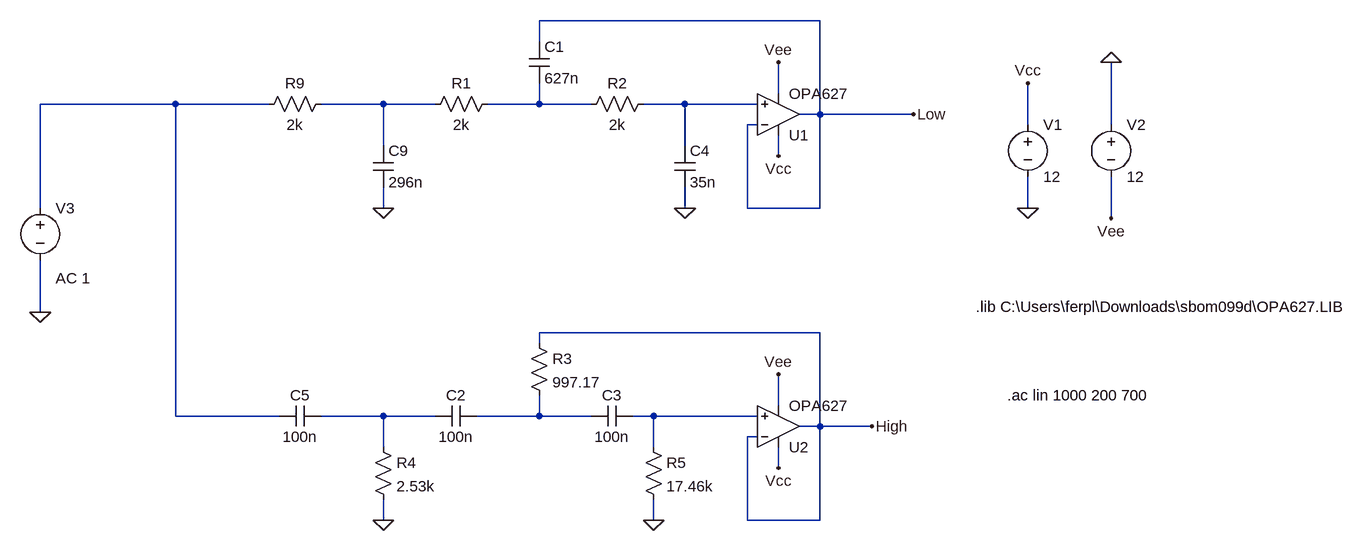
[diagram p0: schematic Butterworth3erOrden.asc]
Butterworth3erOrden.asc, the LTspice schematic file:
Version 4
SHEET 1 1732 884
WIRE 672 96 240 96
WIRE 240 128 240 96
WIRE 608 208 608 160
WIRE -320 224 -528 224
WIRE -176 224 -320 224
WIRE 0 224 -96 224
WIRE 80 224 0 224
WIRE 240 224 240 192
WIRE 240 224 160 224
WIRE 320 224 240 224
WIRE 464 224 400 224
WIRE 576 224 464 224
WIRE 672 240 672 96
WIRE 672 240 640 240
WIRE 816 240 672 240
WIRE 576 256 560 256
WIRE 992 256 992 192
WIRE 1120 256 1120 160
WIRE 0 288 0 224
WIRE 464 288 464 224
WIRE 608 304 608 272
WIRE -528 384 -528 224
WIRE 0 384 0 352
WIRE 464 384 464 352
WIRE 560 384 560 256
WIRE 672 384 672 240
WIRE 672 384 560 384
WIRE 992 384 992 336
WIRE 1120 400 1120 336
WIRE -528 544 -528 464
WIRE 672 576 240 576
WIRE 240 592 240 576
WIRE 608 688 608 640
WIRE -320 704 -320 224
WIRE -160 704 -320 704
WIRE 0 704 -96 704
WIRE 80 704 0 704
WIRE 240 704 240 672
WIRE 240 704 144 704
WIRE 320 704 240 704
WIRE 416 704 384 704
WIRE 576 704 416 704
WIRE 672 720 672 576
WIRE 672 720 640 720
WIRE 752 720 672 720
WIRE 576 736 560 736
WIRE 0 752 0 704
WIRE 416 752 416 704
WIRE 608 784 608 752
WIRE 0 864 0 832
WIRE 416 864 416 832
WIRE 560 864 560 736
WIRE 672 864 672 720
WIRE 672 864 560 864
FLAG 992 384 0
FLAG 1120 160 0
FLAG 992 192 Vcc
FLAG 1120 400 Vee
FLAG 464 384 0
FLAG 816 240 Low
FLAG 608 304 Vcc
FLAG 608 160 Vee
FLAG 752 720 High
FLAG 0 384 0
FLAG 416 864 0
FLAG 608 784 Vcc
FLAG 608 640 Vee
FLAG 0 864 0
FLAG -528 544 0
SYMBOL OpAmps\\opamp2 608 304 M180
SYMATTR InstName U1
SYMATTR Value OPA627
SYMBOL voltage 992 240 R0
WINDOW 123 0 0 Left 0
WINDOW 39 0 0 Left 0
SYMATTR InstName V1
SYMATTR Value 12
SYMBOL voltage 1120 240 R0
WINDOW 123 0 0 Left 0
WINDOW 39 0 0 Left 0
SYMATTR InstName V2
SYMATTR Value 12
SYMBOL res 176 208 R90
WINDOW 0 0 56 VBottom 2
WINDOW 3 32 56 VTop 2
SYMATTR InstName R1
SYMATTR Value 2k
SYMBOL res 416 208 R90
WINDOW 0 0 56 VBottom 2
WINDOW 3 32 56 VTop 2
SYMATTR InstName R2
SYMATTR Value 2k
SYMBOL cap 224 128 R0
SYMATTR InstName C1
SYMATTR Value 627n
SYMBOL cap 448 288 R0
SYMATTR InstName C4
SYMATTR Value 35n
SYMBOL res -80 208 R90
WINDOW 0 0 56 VBottom 2
WINDOW 3 32 56 VTop 2
SYMATTR InstName R9
SYMATTR Value 2k
SYMBOL cap -16 288 R0
SYMATTR InstName C9
SYMATTR Value 296n
SYMBOL OpAmps\\opamp2 608 784 M180
SYMATTR InstName U2
SYMATTR Value OPA627
SYMBOL cap 144 688 R90
WINDOW 0 0 32 VBottom 2
WINDOW 3 32 32 VTop 2
SYMATTR InstName C2
SYMATTR Value 100n
SYMBOL cap 384 688 R90
WINDOW 0 0 32 VBottom 2
WINDOW 3 32 32 VTop 2
SYMATTR InstName C3
SYMATTR Value 100n
SYMBOL cap -96 688 R90
WINDOW 0 0 32 VBottom 2
WINDOW 3 32 32 VTop 2
SYMATTR InstName C5
SYMATTR Value 100n
SYMBOL res 224 576 R0
SYMATTR InstName R3
SYMATTR Value 997.17
SYMBOL res -16 736 R0
SYMATTR InstName R4
SYMATTR Value 2.53k
SYMBOL res 400 736 R0
SYMATTR InstName R5
SYMATTR Value 17.46k
SYMBOL voltage -528 368 R0
WINDOW 123 24 124 Left 2
WINDOW 39 0 0 Left 0
SYMATTR InstName V3
SYMATTR Value ""
SYMATTR Value2 AC 1
TEXT 912 536 Left 2 !.lib C:\\Users\\ferpl\\Downloads\\sbom099d\\OPA627.LIB
TEXT 960 672 Left 2 !.ac lin 1000 200 700

The netlist it stands for:
* Butterworth3erOrden.asc
XU1 N004 Low Vcc Vee Low OPA627  ; pins In+ In- V+ V- OUT
V1 Vcc 0 12
V2 0 Vee 12
R1 N003 N002 2k
R2 N004 N003 2k
C1 Low N003 627n
C4 N004 0 35n
R9 N002 N001 2k
C9 N002 0 296n
XU2 N007 High Vcc Vee High OPA627  ; pins In+ In- V+ V- OUT
C2 N006 N005 100n
C3 N007 N006 100n
C5 N005 N001 100n
R3 High N006 997.17
R4 N005 0 2.53k
R5 N007 0 17.46k
V3 N001 0 AC 1
.lib C:\Users\ferpl\Downloads\sbom099d\OPA627.LIB
.ac lin 1000 200 700
.backanno
.end